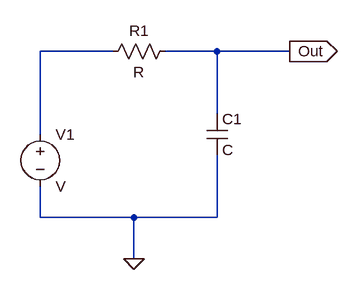
[diagram p0: schematic 25.1_2.(1).asc]
25.1_2.(1).asc, the LTspice schematic file:
Version 4
SHEET 1 880 680
WIRE 0 128 -112 128
WIRE 160 128 80 128
WIRE 272 128 160 128
WIRE 160 224 160 128
WIRE -112 256 -112 128
WIRE -112 384 -112 336
WIRE 32 384 -112 384
WIRE 160 384 160 288
WIRE 160 384 32 384
WIRE 32 448 32 384
FLAG 272 128 Out
IOPIN 272 128 Out
FLAG 32 448 0
SYMBOL cap 144 224 R0
SYMATTR InstName C1
SYMBOL res 96 112 R90
WINDOW 0 0 56 VBottom 2
WINDOW 3 32 56 VTop 2
SYMATTR InstName R1
SYMBOL voltage -112 240 R0
SYMATTR InstName V1

The netlist it stands for:
* 25.1_2.(1).asc
C1 Out 0 C
R1 Out N001 R
V1 N001 0 V
.backanno
.end